# Altium schematic sheet SRAM&Flash.SchDoc
size A4; Revision: D.1(PCB.SCH)
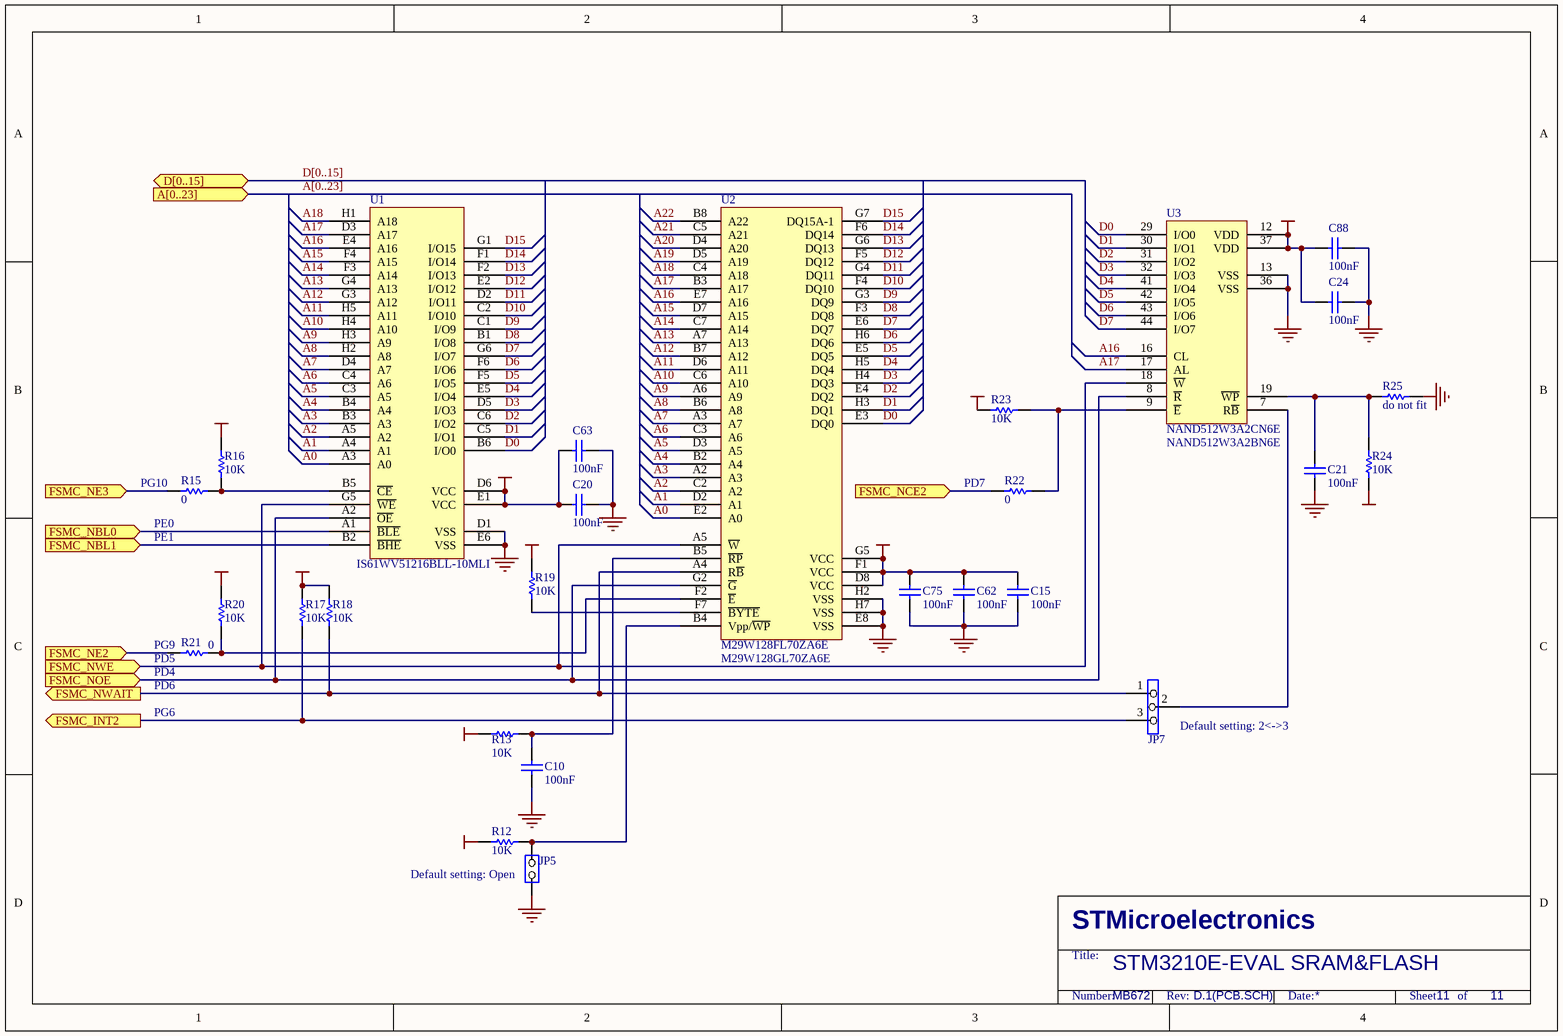
[diagram p0: SRAM&Flash.SchDoc]

## Parts
C10  100nF  [0603]
C15  100nF  [0603]
C20  100nF  [0603]
C21  100nF  [0603]
C24  100nF  [0603]
C62  100nF  [0603]
C63  100nF  [0603]
C75  100nF  [0603]
C88  100nF  [0603]
JP5  (no value)  [SIP2]
JP7  (no value)  [SIP3]
R12  10K  [0603]
R13  10K  [0603]
R15  0  [0603]
R16  10K  [0603]
R17  10K  [0603]
R18  10K  [0603]
R19  10K  [0603]
R20  10K  [0603]
R21  0  [0603]
R22  0  [0603]
R23  10K  [0603]
R24  10K  [0603]
R25  do not fit  [0603]
U1  IS61WV51216BLL-10MLI  [FBGA48]
U2  M29W128FL70ZA6E  [TBGA64(10x13)]
U3  NAND512W3A2CN6E  [TSOP48]

## Ports
A[0..23] (in), D[0..15] (bidir), FSMC_INT2 (out), FSMC_NBL0 (in), FSMC_NBL1 (in), FSMC_NCE2 (in), FSMC_NE2 (in), FSMC_NE3 (in), FSMC_NOE (in), FSMC_NWAIT (out), FSMC_NWE (in)

## Nets
+3V3: C15.2 C20.2 C24.2 C62.2 C63.2 C75.2 C88.2 R12.1 R13.2 R16.1 R17.2 R18.2 R19.1 R20.2 R23.2 R24.1 U1.D6(VCC) U1.E1(VCC) U2.D8(VCC) U2.F1(VCC) U2.G5(VCC) U3.12(VDD) U3.37(VDD)
GND: C10.2 C15.1 C20.1 C21.1 C24.1 C62.1 C63.1 C75.1 C88.1 JP5.1(COMMON) R25.2 U1.D1(VSS) U1.E6(VSS) U2.E8(VSS) U2.H2(VSS) U2.H7(VSS) U3.13(VSS) U3.36(VSS)
A0: U1.A3(A0) U2.E2(A0)
A1: U1.A4(A1) U2.D2(A1)
A2: U1.A5(A2) U2.C2(A2)
A3: U1.B3(A3) U2.A2(A3)
A4: U1.B4(A4) U2.B2(A4)
A5: U1.C3(A5) U2.D3(A5)
A6: U1.C4(A6) U2.C3(A6)
A7: U1.D4(A7) U2.A3(A7)
A8: U1.H2(A8) U2.B6(A8)
A9: U1.H3(A9) U2.A6(A9)
A10: U1.H4(A10) U2.C6(A10)
A11: U1.H5(A11) U2.D6(A11)
A12: U1.G3(A12) U2.B7(A12)
A13: U1.G4(A13) U2.A7(A13)
A14: U1.F3(A14) U2.C7(A14)
A15: U1.F4(A15) U2.D7(A15)
A16: U1.E4(A16) U2.E7(A16) U3.16(CL)
A17: U1.D3(A17) U2.B3(A17) U3.17(AL)
A18: U1.H1(A18) U2.C4(A18)
A19: U2.D5(A19)
A20: U2.D4(A20)
A21: U2.C5(A21)
A22: U2.B8(A22)
D0: U1.B6(I/O0) U2.E3(DQ0) U3.29(I/O0)
D1: U1.C5(I/O1) U2.H3(DQ1) U3.30(I/O1)
D2: U1.C6(I/O2) U2.E4(DQ2) U3.31(I/O2)
D3: U1.D5(I/O3) U2.H4(DQ3) U3.32(I/O3)
D4: U1.E5(I/O4) U2.H5(DQ4) U3.41(I/O4)
D5: U1.F5(I/O5) U2.E5(DQ5) U3.42(I/O5)
D6: U1.F6(I/O6) U2.H6(DQ6) U3.43(I/O6)
D7: U1.G6(I/O7) U2.E6(DQ7) U3.44(I/O7)
D8: U1.B1(I/O8) U2.F3(DQ8)
D9: U1.C1(I/O9) U2.G3(DQ9)
D10: U1.C2(I/O10) U2.F4(DQ10)
D11: U1.D2(I/O11) U2.G4(DQ11)
D12: U1.E2(I/O12) U2.F5(DQ12)
D13: U1.F2(I/O13) U2.G6(DQ13)
D14: U1.F1(I/O14) U2.F6(DQ14)
D15: U1.G1(I/O15) U2.G7(DQ15A-1)
FSMC_INT2: JP7.3 R17.1 ; port FSMC_INT2
FSMC_NBL0: U1.A1(~{BLE}) ; port FSMC_NBL0
FSMC_NBL1: U1.B2(~{BHE}) ; port FSMC_NBL1
FSMC_NCE2: R22.1 ; port FSMC_NCE2
FSMC_NE2: R21.1 ; port FSMC_NE2
FSMC_NE3: R15.1 ; port FSMC_NE3
FSMC_NOE: U1.A2(~{OE}) U2.G2(~{G}) U3.8(~{R}) ; port FSMC_NOE
FSMC_NWAIT: JP7.1 R18.1 U2.A4(R~{B}) ; port FSMC_NWAIT
FSMC_NWE: U1.G5(~{WE}) U2.A5(~{W}) U3.18(~{W}) ; port FSMC_NWE
NetC10_1: C10.1 R13.1 U2.B5(~{RP})
NetC21_2: C21.2 R24.2 R25.1 U3.19(~{WP})
NetJP5_2: JP5.2(NO) R12.2 U2.B4(Vpp/~{WP})
NetJP7_2: JP7.2 U3.7(R~{B})
NetR15_2: R15.2 R16.2 U1.B5(~{CE})
NetR19_2: R19.2 U2.F7(~{BYTE})
NetR20_1: R20.1 R21.2 U2.F2(~{E})
NetR22_2: R22.2 R23.1 U3.9(~{E})

Not connected (* = marked no-connect by the designer): U3 1(NC) 2(NC) 3(NC) 4(NC) 5(NC) 6(NC) 10(NC) 11(NC) 14(NC) 15(NC) 20(NC) 21(NC) 22(NC) 23(NC) 24(NC) 25(NC) 26(NC) 27(NC) 28(NC) 33(NC) 34(NC) 35(NC) 38(NC) 39(NC) 40(NC) 45(NC) 46(NC) 47(NC) 48(NC)

## Buses and harness runs
bus A[0..23] = port A[0..23]
bus D[0..15] = port D[0..15]

## Notes on the sheet
- (near U3) NAND512W3A2BN6E
- (near R15) PG10
- (near R22) PD7
- (near R15) PE1
- (near R15) PE0
- (near R21) PG9
- (near R21) PD5
- (near R21) PD6
- (near R21) PD4
- PG6
- (near U2) M29W128GL70ZA6E
- (near JP7) Default setting: 2<->3
- (near JP5) Default setting: Open
- STM3210E-EVAL SRAM&FLASH
- MB672
- 11
- STMicroelectronics
- Title:
- Number:
- Rev:
- Date:
- Sheet       of

## Library data of the parts
C10 C15 C20 C21 C24 C62 C63 C75 C88 = cap: Capacitor; Value: 100pF; Published: 8-Jun-2000; Revision: July-2002: Re-released for DXP Platform.; Publisher: Altium Limited
JP5 = JP2
JP7 = Jumper3
R12 R13 R15-R25 = Res1: Resistor; Value: 1K; Published: 8-Jun-2000; Revision: July-2002: Re-released for DXP Platform.; Publisher: Altium Limited
U1 = IS64WV51216BLL-10MA3
U3 = NAND01GW3B2BN: 1G/8bits/3.3V/large page/